# Altium schematic sheet 外围电路.SchDoc
size A4; DocumentNumber: 6; SheetNumber: 6; SheetTotal: 34
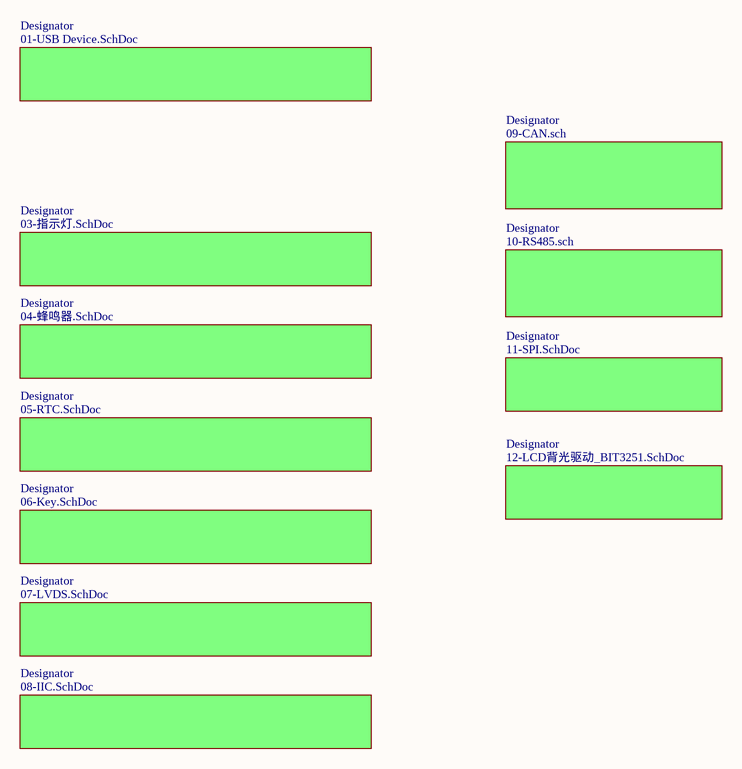
[diagram p0: 外围电路.SchDoc]

## Sub-sheets
Designator = 10-RS485.sch: no entries
Designator = 12-LCD背光驱动_BIT3251.SchDoc: no entries
Designator = 09-CAN.sch: no entries
Designator = 04-蜂鸣器.SchDoc: no entries
Designator = 05-RTC.SchDoc: no entries
Designator = 03-指示灯.SchDoc: no entries
Designator = 07-LVDS.SchDoc: no entries
Designator = 01-USB Device.SchDoc: no entries
Designator = 06-Key.SchDoc: no entries
Designator = 08-IIC.SchDoc: no entries
Designator = 11-SPI.SchDoc: no entries